# EAGLE design sel (EAGLE 9.6.2)

## Sheet 1 of 2
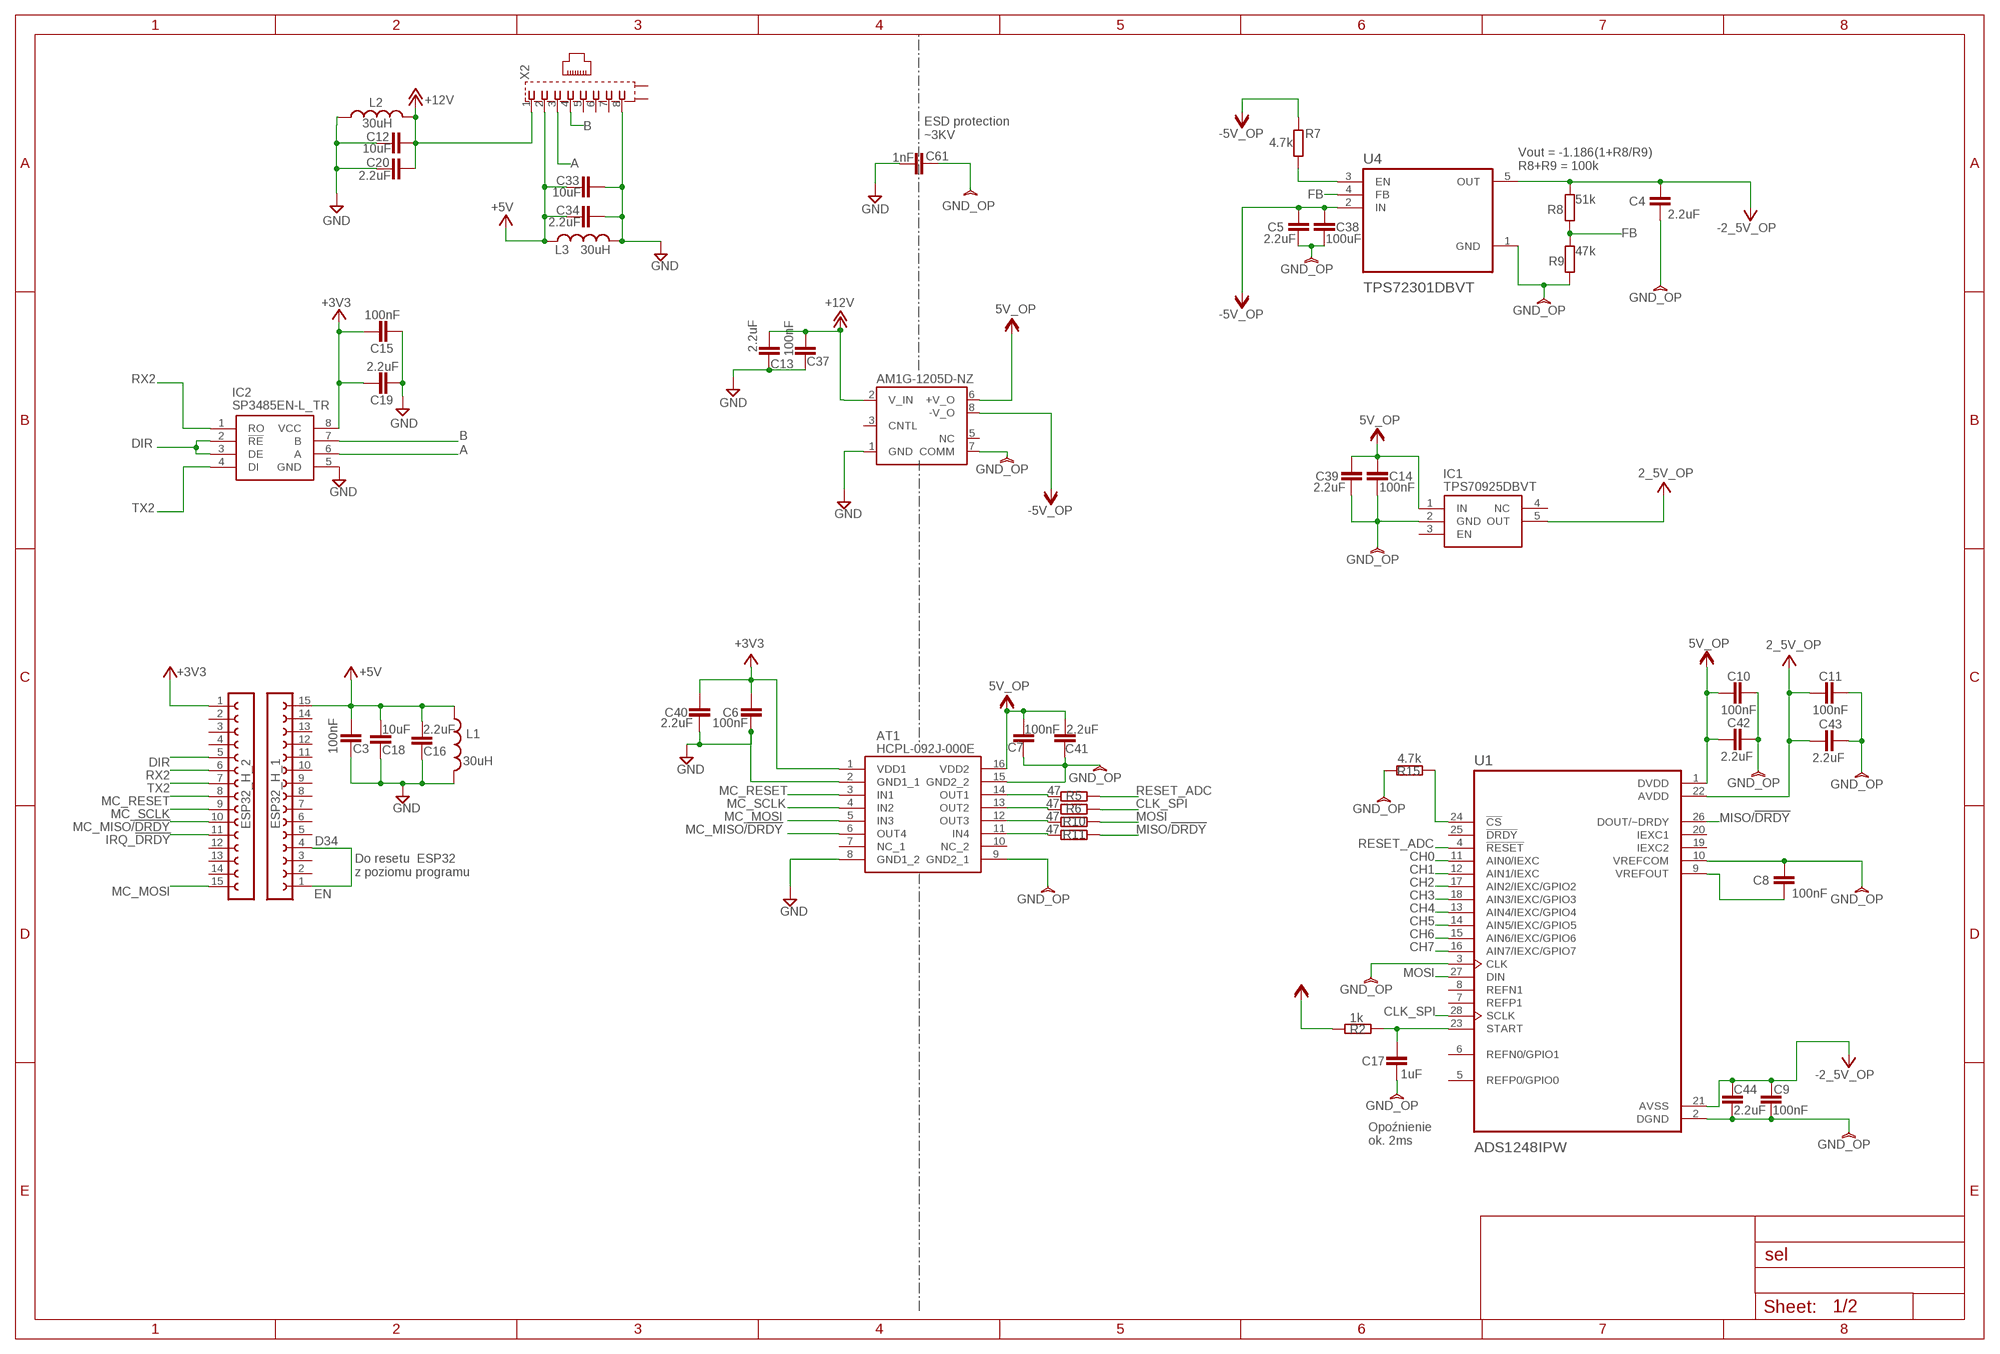
[diagram p0: schematic, sheet 1]

### Parts
AM1G-1205D-NZ  AM1G-1205D-NZ  [AM1G-1205D-NZ]
AT1  HCPL-092J-000E  [SOIC127P600X188-16N]
C3  100nF  C-EUC1206  [C1206]
C4  2.2uF  C-EUC1206  [C1206]
C5  2.2uF  C-EUC1206  [C1206]
C6  100nF  C-EUC1206  [C1206]
C7  100nF  C-EUC1206  [C1206]
C8  100nF  C-EUC1206  [C1206]
C9  100nF  C-EUC1206  [C1206]
C10  100nF  C-EUC1206  [C1206]
C11  100nF  C-EUC1206  [C1206]
C12  10uF  C-EUC1206  [C1206]
C13  2.2uF  C-EUC1206  [C1206]
C14  100nF  C-EUC1206  [C1206]
C15  100nF  C-EUC1206  [C1206]
C16  2.2uF  C-EUC1206  [C1206]
C17  1uF  C-EUC1206  [C1206]
C18  10uF  C-EUC1206  [C1206]
C19  2.2uF  C-EUC1206  [C1206]
C20  2.2uF  C-EUC1206  [C1206]
C33  10uF  C-EUC1206  [C1206]
C34  2.2uF  C-EUC1206  [C1206]
C37  100nF  C-EUC1206  [C1206]
C38  100uF  C-EUC1206  [C1206]
C39  2.2uF  C-EUC1206  [C1206]
C40  2.2uF  C-EUC1206  [C1206]
C41  2.2uF  C-EUC1206  [C1206]
C42  2.2uF  C-EUC1206  [C1206]
C43  2.2uF  C-EUC1206  [C1206]
C44  2.2uF  C-EUC1206  [C1206]
C61  1nF  C-EUC1206  [C1206]
ESP32_H_1  FE15-1  [FE15]
ESP32_H_2  FE15-1  [FE15]
IC1  TPS70925DBVT  [SOT95P280X145-5N]
IC2  SP3485EN-L_TR  [SOIC127P600X175-8N]
L1  30uH  L-US0204/7  [0204/7]
L2  30uH  L-US0204/7  [0204/7]
L3  30uH  L-US0204/7  [0204/7]
R2  1k  R-EU_R1206  [R1206]
R5  47  R-EU_R1206  [R1206]
R6  47  R-EU_R1206  [R1206]
R7  4.7k  R-EU_R1206  [R1206]
R8  51k  R-EU_R1206  [R1206]
R9  47k  R-EU_R1206  [R1206]
R10  47  R-EU_R1206  [R1206]
R11  47  R-EU_R1206  [R1206]
R15  4.7k  R-EU_R1206  [R1206]
U1  ADS1248IPW  [SOP65P640X120-28N]
U4  TPS72301DBVT  [SOT95P280X145-5N]
X2  0446200002  [0446200002]

### Nets
2_5V_OP: C11.2 C43.2 IC1.5(OUT) U1.22(AVDD)
5V_OP: AM1G-1205D-NZ.6(+V_O) AT1.16(VDD2) C7.1 C10.2 C14.1 C39.1 C41.1 C42.2 IC1.1(IN) R2.2 U1.1(DVDD) ; also sheet 2
+3V3: AT1.1(VDD1) C6.2 C15.2 C19.2 C40.2 ESP32_H_2.1 IC2.8(VCC)
+5V: C3.1 C16.1 C18.1 C33.2 C34.2 ESP32_H_1.15 L1.1 L3.1 X2.2
+12V: AM1G-1205D-NZ.2(V_IN) C12.1 C13.2 C20.1 C37.2 L2.2 X2.1
-2_5V_OP: C4.1 C9.1 C44.1 R8.2 U1.21(AVSS) U4.5(OUT)
-5V_OP: AM1G-1205D-NZ.8(-V_O) C5.1 C38.1 R7.1 U4.2(IN) ; also sheet 2
A: IC2.6(A) X2.3
B: IC2.7(B) X2.4
CH0: U1.11(AIN0/IEXC) ; also sheet 2
CH1: U1.12(AIN1/IEXC) ; also sheet 2
CH2: U1.17(AIN2/IEXC/GPIO2) ; also sheet 2
CH3: U1.18(AIN3/IEXC/GPIO3) ; also sheet 2
CH4: U1.13(AIN4/IEXC/GPIO4) ; also sheet 2
CH5: U1.14(AIN5/IEXC/GPIO5) ; also sheet 2
CH6: U1.15(AIN6/IEXC/GPIO6)
CH7: U1.16(AIN7/IEXC/GPIO7)
CLK_SPI: AT1.13(OUT2) R6.2 U1.28(SCLK)
DIR: ESP32_H_2.5 IC2.2(!RE) IC2.3(DE)
EN: ESP32_H_1.1 ESP32_H_1.4
FB: R8.1 R9.2 U4.4(FB)
GND: AM1G-1205D-NZ.1(GND) AT1.2(GND1_1) AT1.8(GND1_2) C3.2 C6.1 C12.2 C13.1 C15.1 C16.2 C18.2 C19.1 C20.2 C33.1 C34.1 C37.1 C40.1 C61.2 IC2.5(GND) L1.2 L2.1 L3.2 X2.8
GND_OP: AM1G-1205D-NZ.7(COMM) AT1.9(GND2_1) AT1.15(GND2_2) C4.2 C5.2 C7.2 C8.1 C9.2 C10.1 C11.1 C14.2 C17.2 C38.2 C39.2 C41.2 C42.1 C43.1 C44.2 C61.1 IC1.2(GND) R9.1 R15.2 U1.2(DGND) U1.3(CLK) U1.10(VREFCOM) U4.1(GND) ; also sheet 2
IRQ_!DRDY: ESP32_H_2.11
MC_MISO/!DRDY: AT1.6(OUT4) ESP32_H_2.10
MC_MOSI: AT1.5(IN3) ESP32_H_2.15
MC_RESET: AT1.3(IN1) ESP32_H_2.8
MC_SCLK: AT1.4(IN2) ESP32_H_2.9
MISO/!DRDY: AT1.11(IN4) R11.2 U1.26(DOUT/~DRDY)
MOSI: AT1.12(OUT3) R10.2 U1.27(DIN)
N$5: R5.1
N$6: R7.2 U4.3(EN)
N$7: R6.1
N$8: C8.2 U1.9(VREFOUT)
N$9: R10.1
N$10: R11.1
N$11: R15.1 U1.24(!CS)
RESET_ADC: AT1.14(OUT1) R5.2 U1.4(!RESET)
RX2: ESP32_H_2.6 IC2.1(RO)
START: C17.1 R2.1 U1.23(START)
TX2: ESP32_H_2.7 IC2.4(DI)
Unconnected: AM1G-1205D-NZ.3(CNTL) AM1G-1205D-NZ.5(NC) AT1.7(NC_1) AT1.10(NC_2) ESP32_H_1.2 ESP32_H_1.3 ESP32_H_1.5 ESP32_H_1.6 ESP32_H_1.7 ESP32_H_1.8 ESP32_H_1.9 ESP32_H_1.10 ESP32_H_1.11 ESP32_H_1.12 ESP32_H_1.13 ESP32_H_1.14 ESP32_H_2.2 ESP32_H_2.3 ESP32_H_2.4 ESP32_H_2.12 ESP32_H_2.13 ESP32_H_2.14 IC1.3(EN) IC1.4(NC) U1.5(REFP0/GPIO0) U1.6(REFN0/GPIO1) U1.7(REFP1) U1.8(REFN1) U1.19(IEXC2) U1.20(IEXC1) U1.25(!DRDY) X2.5 X2.6 X2.7 X2.S@1(S1) X2.S@2(S2)

### Notes on the sheet
- ESD protection
  ~3KV
- Vout = -1.186(1+R8/R9)
  R8+R9 = 100k
- D34
- Do resetu  ESP32
  z poziomu programu
- Opoźnienie 
  ok. 2ms

## Sheet 2 of 2
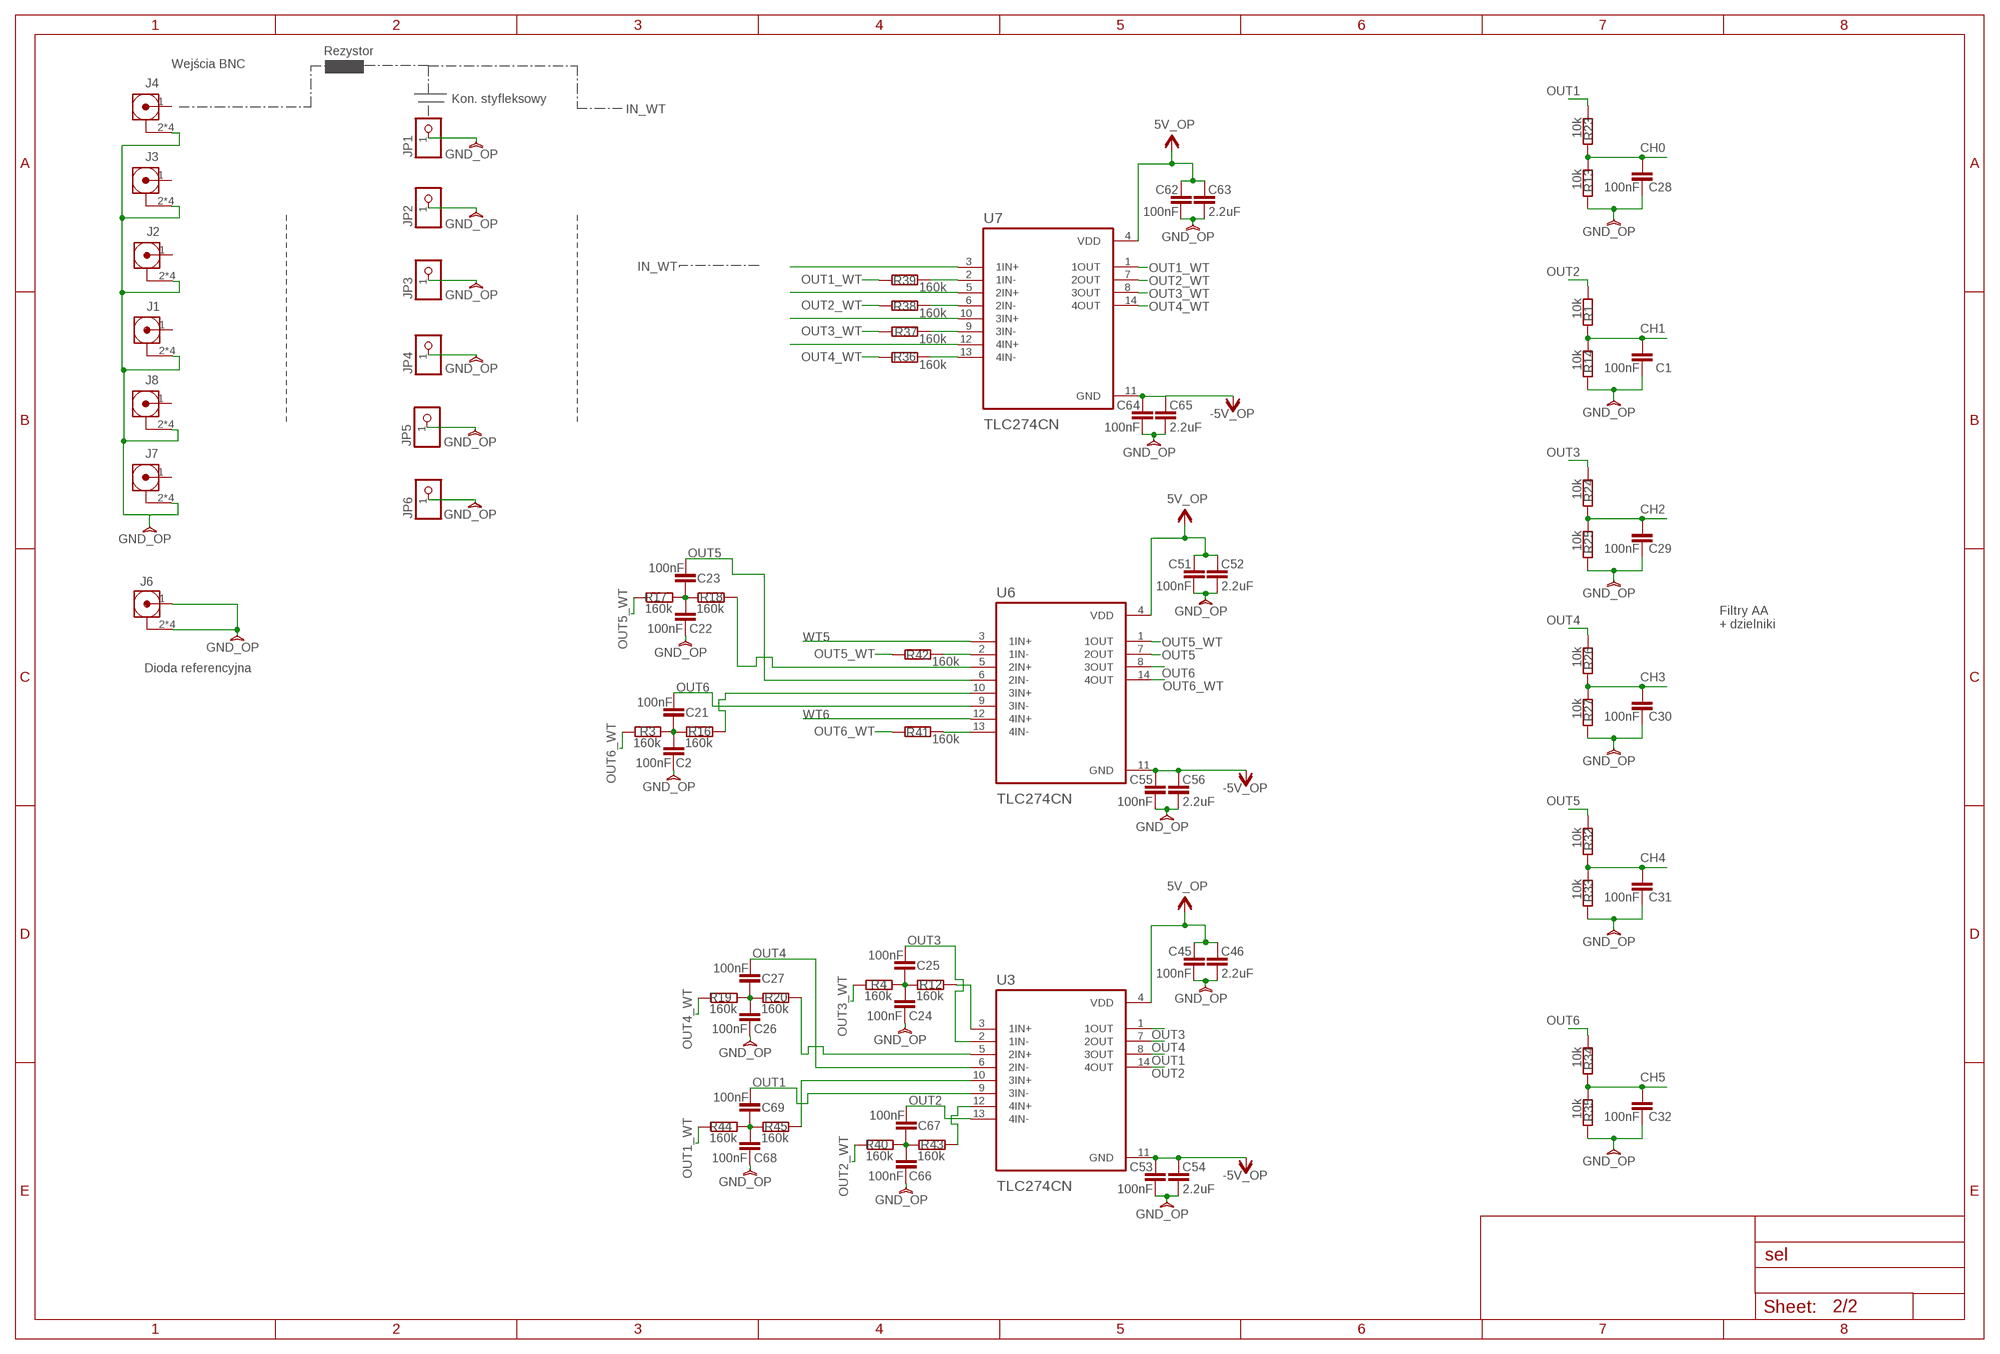
[diagram p1: schematic, sheet 2]

### Parts
C1  100nF  C-EUC1206  [C1206]
C2  100nF  C-EUC1206  [C1206]
C21  100nF  C-EUC1206  [C1206]
C22  100nF  C-EUC1206  [C1206]
C23  100nF  C-EUC1206  [C1206]
C24  100nF  C-EUC1206  [C1206]
C25  100nF  C-EUC1206  [C1206]
C26  100nF  C-EUC1206  [C1206]
C27  100nF  C-EUC1206  [C1206]
C28  100nF  C-EUC1206  [C1206]
C29  100nF  C-EUC1206  [C1206]
C30  100nF  C-EUC1206  [C1206]
C31  100nF  C-EUC1206  [C1206]
C32  100nF  C-EUC1206  [C1206]
C45  100nF  C-EUC1206  [C1206]
C46  2.2uF  C-EUC1206  [C1206]
C51  100nF  C-EUC1206  [C1206]
C52  2.2uF  C-EUC1206  [C1206]
C53  100nF  C-EUC1206  [C1206]
C54  2.2uF  C-EUC1206  [C1206]
C55  100nF  C-EUC1206  [C1206]
C56  2.2uF  C-EUC1206  [C1206]
C62  100nF  C-EUC1206  [C1206]
C63  2.2uF  C-EUC1206  [C1206]
C64  100nF  C-EUC1206  [C1206]
C65  2.2uF  C-EUC1206  [C1206]
C66  100nF  C-EUC1206  [C1206]
C67  100nF  C-EUC1206  [C1206]
C68  100nF  C-EUC1206  [C1206]
C69  100nF  C-EUC1206  [C1206]
J1  5-1634556-0  [TE_5-1634556-0]
J2  5-1634556-0  [TE_5-1634556-0]
J3  5-1634556-0  [TE_5-1634556-0]
J4  5-1634556-0  [TE_5-1634556-0]
J6  5-1634556-0  [TE_5-1634556-0]
J7  5-1634556-0  [TE_5-1634556-0]
J8  5-1634556-0  [TE_5-1634556-0]
JP1  PINHD-1X1  [1X01]
JP2  PINHD-1X1  [1X01]
JP3  PINHD-1X1  [1X01]
JP4  PINHD-1X1  [1X01]
JP5  PINHD-1X1  [1X01]
JP6  PINHD-1X1  [1X01]
R1  10k  R-EU_R1206  [R1206]
R3  160k  R-EU_R1206  [R1206]
R4  160k  R-EU_R1206  [R1206]
R12  160k  R-EU_R1206  [R1206]
R13  10k  R-EU_R1206  [R1206]
R14  10k  R-EU_R1206  [R1206]
R16  160k  R-EU_R1206  [R1206]
R17  160k  R-EU_R1206  [R1206]
R18  160k  R-EU_R1206  [R1206]
R19  160k  R-EU_R1206  [R1206]
R20  160k  R-EU_R1206  [R1206]
R23  10k  R-EU_R1206  [R1206]
R24  10k  R-EU_R1206  [R1206]
R25  10k  R-EU_R1206  [R1206]
R26  10k  R-EU_R1206  [R1206]
R27  10k  R-EU_R1206  [R1206]
R32  10k  R-EU_R1206  [R1206]
R33  10k  R-EU_R1206  [R1206]
R34  10k  R-EU_R1206  [R1206]
R35  10k  R-EU_R1206  [R1206]
R36  160k  R-EU_R1206  [R1206]
R37  160k  R-EU_R1206  [R1206]
R38  160k  R-EU_R1206  [R1206]
R39  160k  R-EU_R1206  [R1206]
R40  160k  R-EU_R1206  [R1206]
R41  160k  R-EU_R1206  [R1206]
R42  160k  R-EU_R1206  [R1206]
R43  160k  R-EU_R1206  [R1206]
R44  160k  R-EU_R1206  [R1206]
R45  160k  R-EU_R1206  [R1206]
U3  TLC274CN  [DIP794W45P254L1969H508Q14]
U6  TLC274CN  [DIP794W45P254L1969H508Q14]
U7  TLC274CN  [DIP794W45P254L1969H508Q14]

### Nets
1IN+: U7.3(1IN+)
2IN+: U7.5(2IN+)
3IN+: U7.10(3IN+)
3IN+_2: R16.1 U6.10(3IN+)
4IN+: U7.12(4IN+)
5V_OP: C45.2 C46.2 C51.2 C52.2 C62.2 C63.2 U3.4(VDD) U6.4(VDD) U7.4(VDD) ; also sheet 1
-5V_OP: C53.2 C54.2 C55.2 C56.2 C64.2 C65.2 U3.11(GND) U6.11(GND) U7.11(GND) ; also sheet 1
CH0: C28.1 R13.2 R23.1 ; also sheet 1
CH1: C1.1 R1.1 R14.2 ; also sheet 1
CH2: C29.1 R24.1 R25.2 ; also sheet 1
CH3: C30.1 R26.1 R27.2 ; also sheet 1
CH4: C31.1 R32.1 R33.2 ; also sheet 1
CH5: C32.1 R34.1 R35.2 ; also sheet 1
GND_OP: C1.2 C2.2 C22.2 C24.2 C26.2 C28.2 C29.2 C30.2 C31.2 C32.2 C45.1 C46.1 C51.1 C52.1 C53.1 C54.1 C55.1 C56.1 C62.1 C63.1 C64.1 C65.1 C66.2 C68.2 J1.2 J1.3 J1.4 J1.5 J2.2 J2.3 J2.4 J2.5 J3.2 J3.3 J3.4 J3.5 J4.2 J4.3 J4.4 J4.5 J6.1 J6.2 J6.3 J6.4 J6.5 J7.2 J7.3 J7.4 J7.5 J8.2 J8.3 J8.4 J8.5 JP1.1 JP2.1 JP3.1 JP4.1 JP5.1 JP6.1 R13.1 R14.1 R25.1 R27.1 R33.1 R35.1 ; also sheet 1
N$1: R41.1 U6.13(4IN-)
N$2: R42.1 U6.2(1IN-)
N$3: R18.1 U6.5(2IN+)
N$12: C24.1 C25.1 R4.1 R12.2
N$15: R12.1 U3.3(1IN+)
N$16: C26.1 C27.1 R19.1 R20.2
N$18: R20.1 U3.5(2IN+)
N$19: C2.1 C21.1 R3.1 R16.2
N$20: C66.1 C67.1 R40.1 R43.2
N$21: C22.1 C23.1 R17.1 R18.2
N$30: C68.1 C69.1 R44.1 R45.2
N$37: R43.1 U3.12(4IN+)
N$38: R45.1 U3.10(3IN+)
N$44: R36.1 U7.13(4IN-)
N$45: R37.1 U7.9(3IN-)
N$46: R38.1 U7.6(2IN-)
N$47: R39.1 U7.2(1IN-)
OUT1: C69.2 R23.2 U3.8(3OUT) U3.9(3IN-)
OUT1_WT: R39.2 R44.2 U7.1(1OUT)
OUT2: C67.2 R1.2 U3.13(4IN-) U3.14(4OUT)
OUT2_WT: R38.2 R40.2 U7.7(2OUT)
OUT3: C25.2 R24.2 U3.1(1OUT) U3.2(1IN-)
OUT3_WT: R4.2 R37.2 U7.8(3OUT)
OUT4: C27.2 R26.2 U3.6(2IN-) U3.7(2OUT)
OUT4_WT: R19.2 R36.2 U7.14(4OUT)
OUT5: C23.2 R32.2 U6.6(2IN-) U6.7(2OUT)
OUT5_WT: R17.2 R42.2 U6.1(1OUT)
OUT6: C21.2 R34.2 U6.8(3OUT) U6.9(3IN-)
OUT6_WT: R3.2 R41.2 U6.14(4OUT)
WT5: U6.3(1IN+)
WT6: U6.12(4IN+)
Unconnected: J1.1 J2.1 J3.1 J4.1 J7.1 J8.1

### Notes on the sheet
- Rezystor
- Wejścia BNC
- Kon. styfleksowy
- IN_WT
- IN_WT
- Filtry AA
  + dzielniki
- Dioda referencyjna

## Library data of the parts
AM1G-1205D-NZ = AM!G-NZ:AM1G-1205D-NZ
AT1 = SamacSys_Parts:HCPL-092J-000E: Broadcom HCPL-092J-000E PCB SMT 3-channel Digital Isolator, 2500 Vrms, 16-Pin SO Source: Datasheet <https://docs.broadcom.com/docs/AV02-0137EN>; DESCRIPTION: Broadcom HCPL-092J-000E PCB SMT 3-channel Digital Isolator, 2500 Vrms, 16-Pin SO; HEIGHT: 1.88mm; MANUFACTURER_NAME: Avago Technologies; MANUFACTURER_PART_NUMBER: HCPL-092J-000E; MOUSER_PART_NUMBER: 630-HCPL-092J-000E; MOUSER_PRICE-STOCK: https://www.mouser.co.uk/ProductDetail/Broadcom-Avago/HCPL-092J-000E?qs=xnajaXqBF9%2FaS9uGq9p%252BqQ%3D%3D
C1-C34 C37-C46 C51-C56 C61-C69 = rcl:C-EU: CAPACITOR, European symbol; SPICEPREFIX: C
ESP32_H_1 ESP32_H_2 = con-lsta:FE15-1: FEMALE HEADER; OC_FARNELL: unknown; OC_NEWARK: unknown
IC1 = SamacSys_Parts:TPS70925DBVT: Texas Instruments TPS70925DBVT, LDO Voltage Regulator, 500mA, 2.5 V 1%, 2.7 30 Vin, 5-Pin SOT-23 Source: Datasheet <http://www.ti.com/lit/gpn/TPS709>; DESCRIPTION: Texas Instruments TPS70925DBVT, LDO Voltage Regulator, 500mA, 2.5 V 1%, 2.7 30 Vin, 5-Pin SOT-23; HEIGHT: 1.45mm; MANUFACTURER_NAME: Texas Instruments; MANUFACTURER_PART_NUMBER: TPS70925DBVT; MOUSER_PART_NUMBER: 595-TPS70925DBVT; MOUSER_PRICE-STOCK: https://www.mouser.co.uk/ProductDetail/Texas-Instruments/TPS70925DBVT?qs=Z9twEOuL%252B%2FLwfjdk3C644Q%3D%3D
IC2 = SamacSys_Parts:SP3485EN-L_TR: RS-485 Interface IC 3.3V LoPwr Half-Dup RS485w/10Mbps Data Source: Datasheet <https://www.maxlinear.com/ds/sp3485.pdf>; DESCRIPTION: RS-485 Interface IC 3.3V LoPwr Half-Dup RS485w/10Mbps Data; HEIGHT: 1.75mm; MANUFACTURER_NAME: MaxLinear, Inc.; MANUFACTURER_PART_NUMBER: SP3485EN-L/TR; MOUSER_PART_NUMBER: 701-SP3485EN-L/TR; MOUSER_PRICE-STOCK: https://www.mouser.co.uk/ProductDetail/MaxLinear/SP3485EN-L-TR?qs=3EMgrMjM0fbQ17liGrle%2Fg%3D%3D
J1-J4 J6-J8 = 5-1634556-0:5-1634556-0: CONN BNC JACK R/A 50 OHM PCB Check prices <https://pricing.snapeda.com/parts/5-1634556-0/TE%20Connectivity/view-part?ref=eda>; AVAILABILITY: Good; COMMENT: 5-1634556-0; DESCRIPTION: Right Angle 50Ohm Thru Hole Bulkhead Fitting BNC Conn; jack; Solder Term Nickel; EU_ROHS_COMPLIANCE: Compliant; MF: TE Connectivity; MP: 5-1634556-0; NUMBER_OF_POSITIONS: 1; PACKAGE: None; PRICE: None; PURCHASE-URL: https://pricing.snapeda.com/search/part/5-1634556-0/?ref=eda
JP1-JP6 = pinhead:PINHD-1X1: PIN HEADER
L1-L3 = rcl:L-US: INDUCTOR, American symbol; SPICEPREFIX: L
R1-R20 R23-R27 R32-R45 = rcl:R-EU_: RESISTOR, European symbol; SPICEPREFIX: R
U1 = ADS1248IPW:ADS1248IPW: Check prices <https://pricing.snapeda.com/parts/ADS1248IPW/Texas%20Instruments/view-part?ref=eda>; AVAILABILITY: Warning; DESCRIPTION: 24-Bit, 2kSPS, 8-Ch Delta-Sigma ADC for Precision Sensor Measurement 28-TSSOP -40 to 125; MF: Texas Instruments; MP: ADS1248IPW; PACKAGE: TSSOP-28 Texas Instruments; PRICE: None; PURCHASE-URL: https://pricing.snapeda.com/search/part/ADS1248IPW/?ref=eda
U3 U6 U7 = TLC274CN:TLC274CN: Check prices <https://pricing.snapeda.com/parts/TLC274CN/Texas%20Instruments/view-part?ref=eda>; AVAILABILITY: Good; DESCRIPTION: Quad Single Supply Operational Amplifier 14-PDIP 0 to 70; MF: Texas Instruments; MP: TLC274CN; PACKAGE: PDIP-14 Texas Instruments; PRICE: None; PURCHASE-URL: https://pricing.snapeda.com/search/part/TLC274CN/?ref=eda
U4 = TPS72301DBVT:TPS72301DBVT: Check prices <https://pricing.snapeda.com/parts/TPS72301DBVT/Texas%20Instruments/view-part?ref=eda>; AVAILABILITY: Good; DESCRIPTION: 200-mA, negative, adjustable low-dropout voltage regulator with enable 5-SOT-23 -40 to 125; MF: Texas Instruments; MP: TPS72301DBVT; PACKAGE: SOT-23-5 Texas Instruments; PRICE: None; PURCHASE-URL: https://pricing.snapeda.com/search/part/TPS72301DBVT/?ref=eda
X2 = con-molex:0446200002: RJ-45 INVERTED MODULAR JACK ASSEMBLY WITH RJ-11 KEEPOUT FEATURE Source: Data sheet <http://www.farnell.com/datasheets/73207.pdf> MOLEX 0446200002 BUCHSE, RJ45, GESCHIRMT Source: Farnell <http://de.farnell.com/molex/0446200002/buchse-rj45-geschirmt/dp/9251910?ost=9251910>; MF: MOLEX; MPN: 0446200002; OC_FARNELL: 9251910

## Board
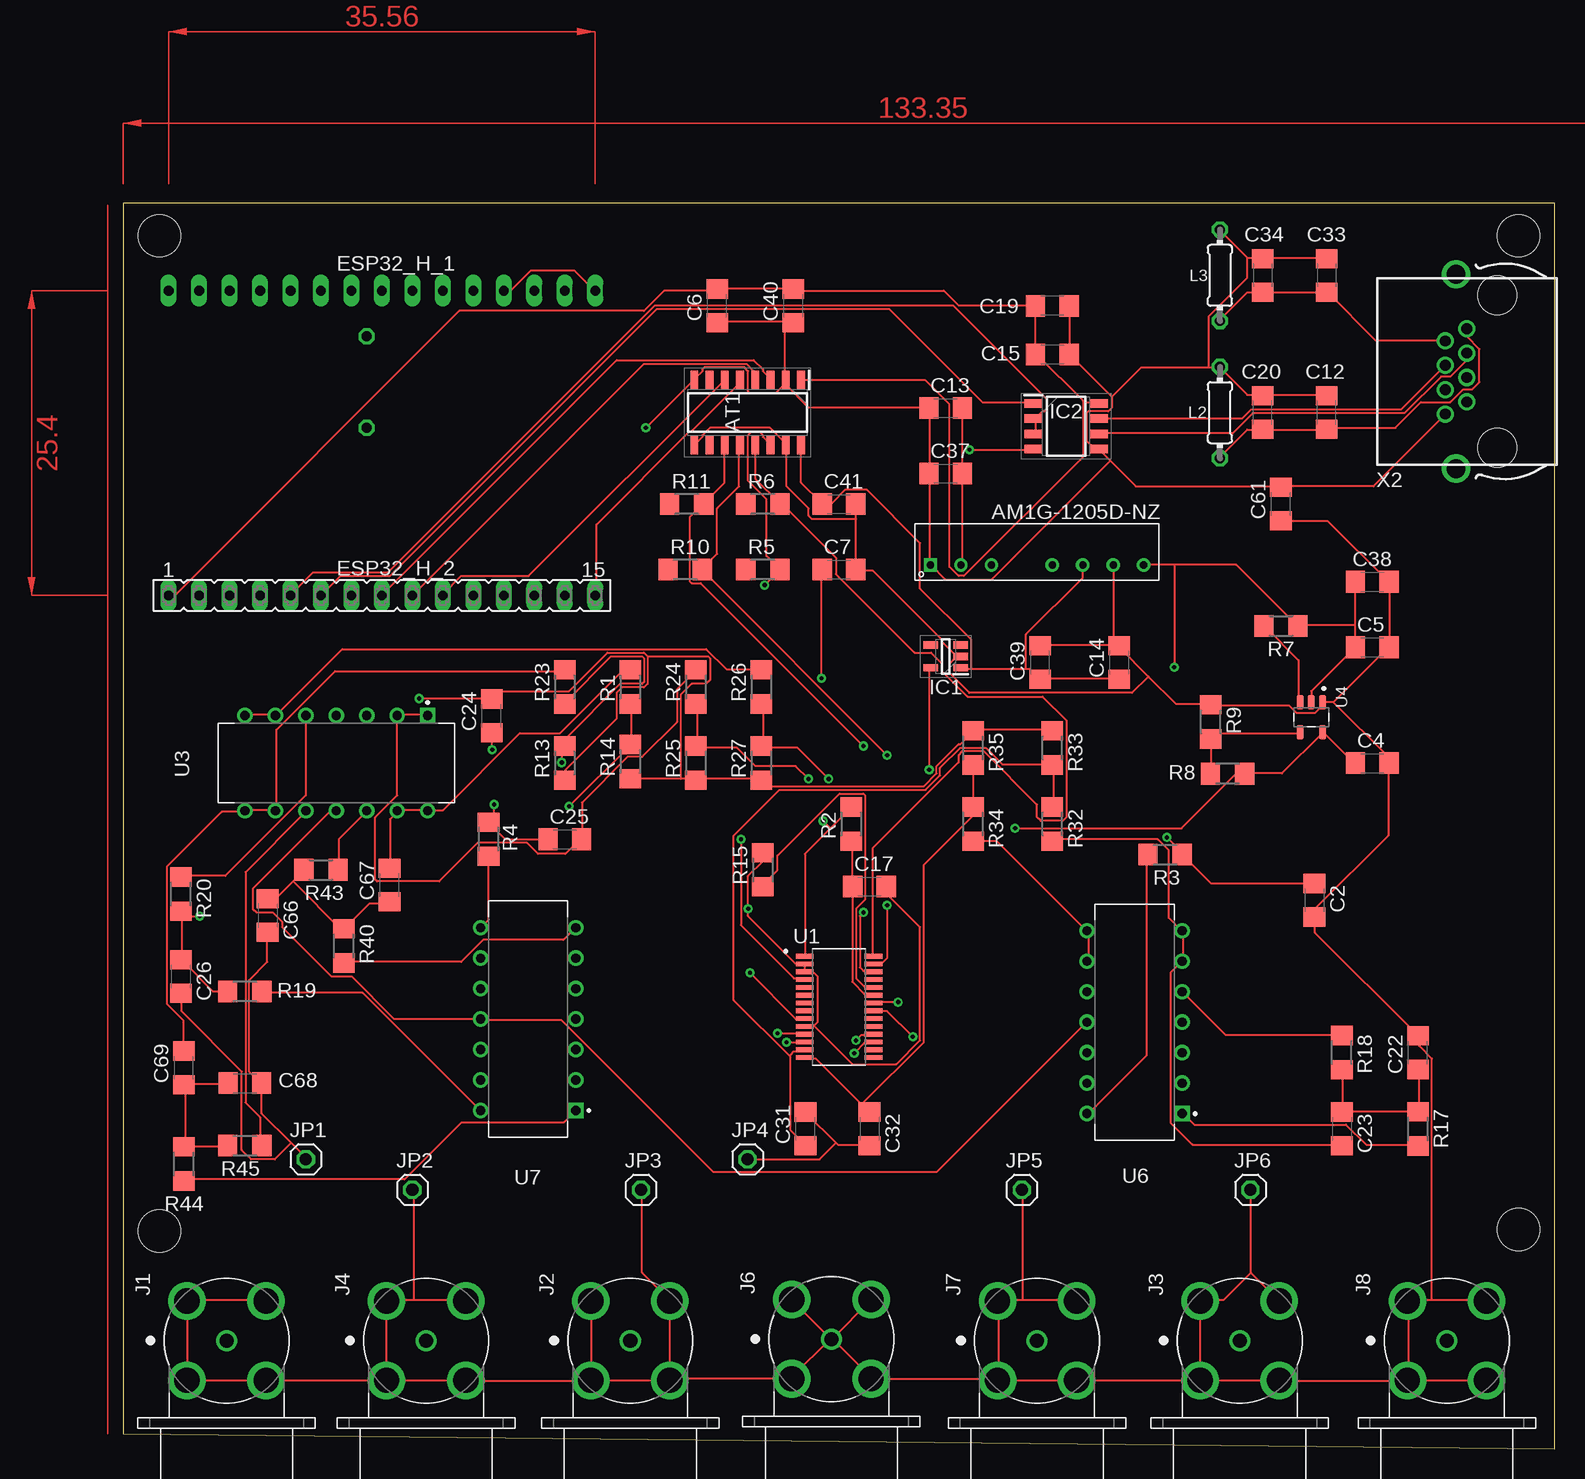
[diagram p2: board, top side]
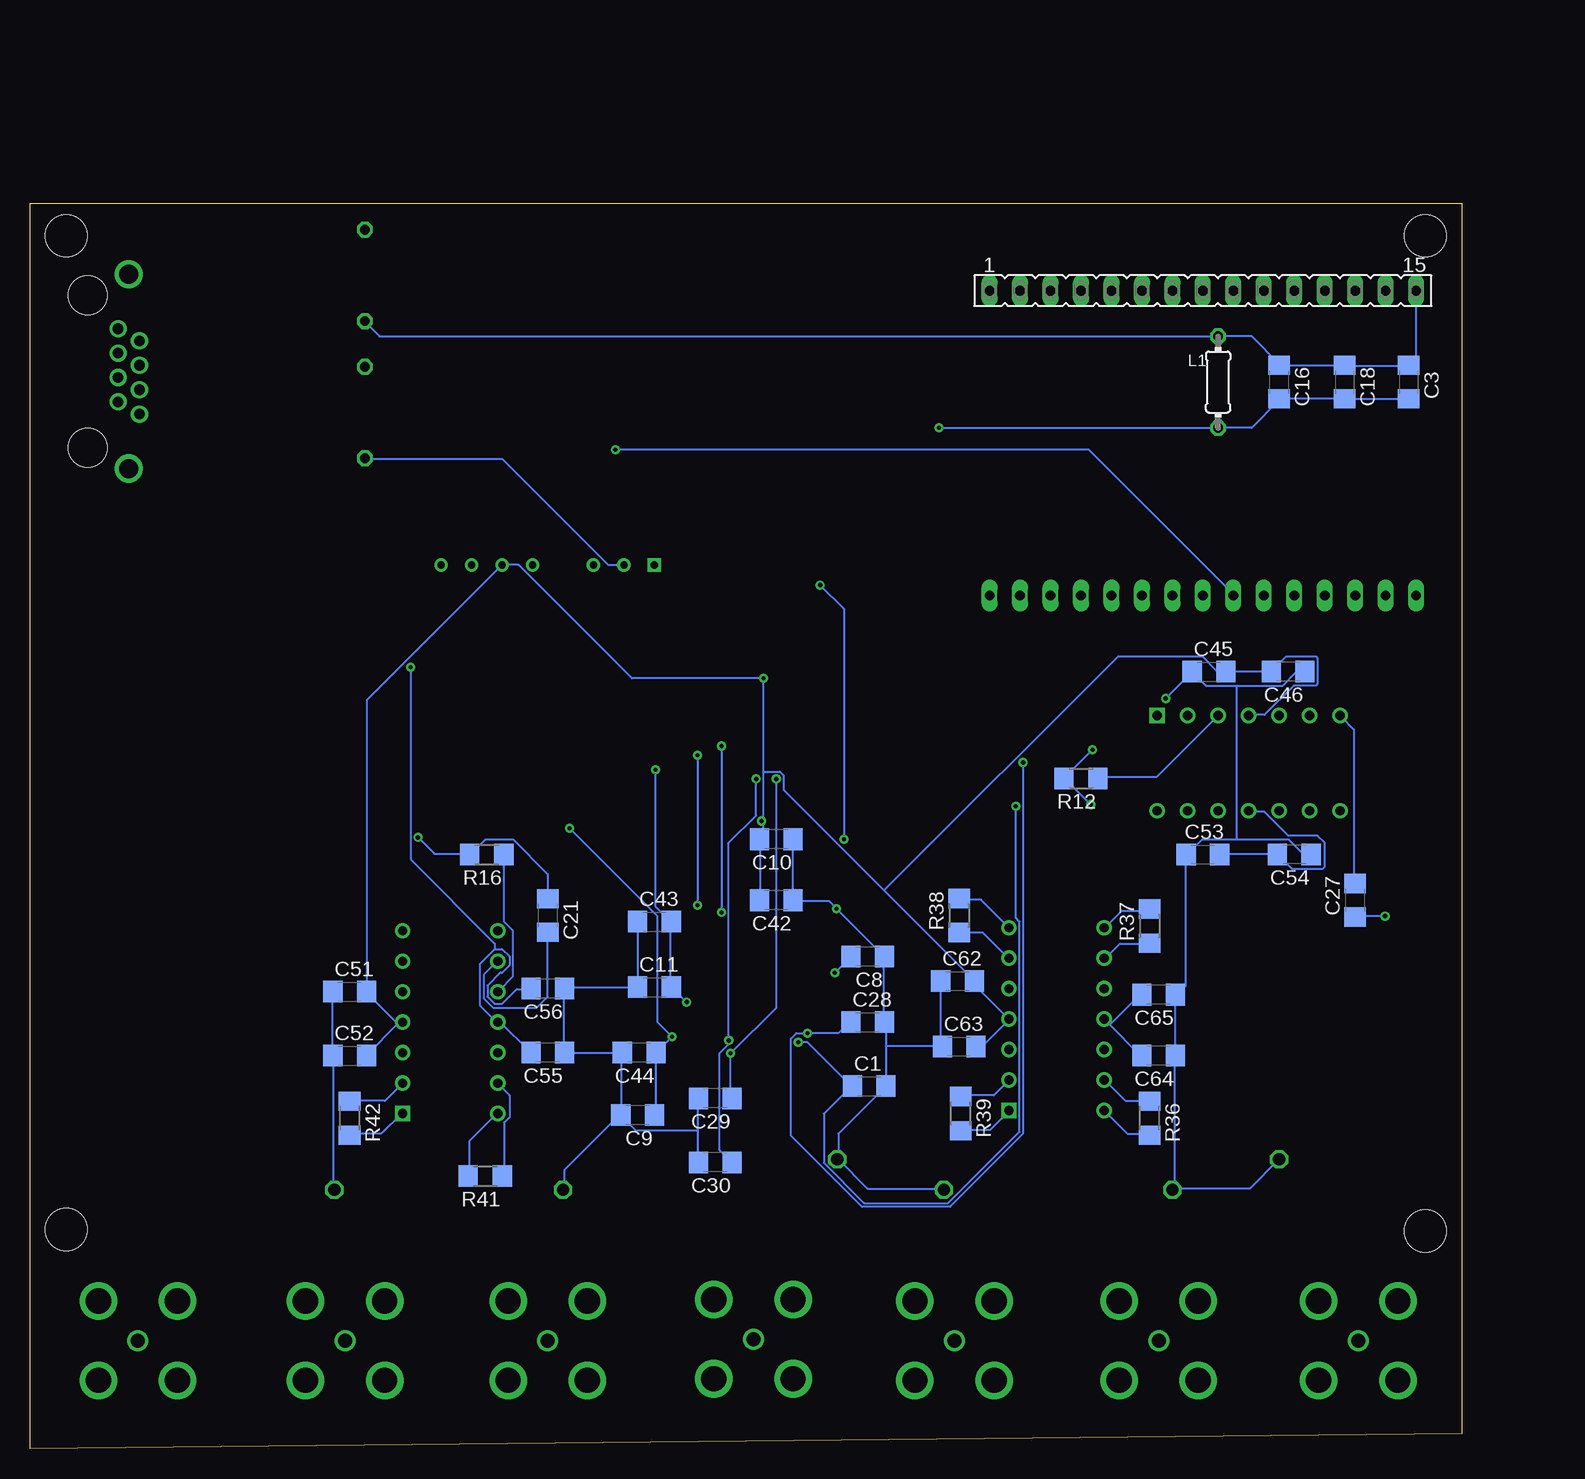
[diagram p3: board, bottom side, seen from below]

Size 119.36 x 103.81 mm. Coordinates in mm from the lower left corner, seen from the top.
Outline: 0,1.27 119.36,0 119.36,103.81 0,103.81 0,1.27
Copper layers (1*16): Top 0.035mm / dielectric 1.5mm / Bottom 0.035mm
Design rules "default": minimum track width 6mil, minimum drill 0.35mm, track to track 6mil, track to pad 6mil, pad to pad 6mil, via to via 6mil, smd to smd 6mil, copper to edge 40mil, drill to drill 6mil, minimum pad ring 10mil, minimum via ring 8mil, stop-mask expansion 4mil, vias tented up to drill 0mil, thermal gap 10mil
Holes 3.5 mm at 116.33,101.09 3.05,101.09 3.05,18.16 116.33,18.29

### Footprints (pad centres in the part's own frame; a part is rotated, then mirrored left to right if it is on the bottom)
AM1G-1205D-NZ = drill 0.6 square: 1 -20.32,0 | drill 0.6: 2 -17.78,0; 3 -15.24,0; 5 -10.16,0; 6 -7.62,0; 7 -5.08,0; 8 -2.54,0
SOIC127P600X188-16N = smd 1.525 x 0.65: 1 -2.712,4.445; 2 -2.712,3.175; 3 -2.712,1.905; 4 -2.712,0.635; 5 -2.712,-0.635; 6 -2.712,-1.905; 7 -2.712,-3.175; 8 -2.712,-4.445; 9 2.712,-4.445; 10 2.712,-3.175; 11 2.712,-1.905; 12 2.712,-0.635; 13 2.712,0.635; 14 2.712,1.905; 15 2.712,3.175; 16 2.712,4.445
C1206 = smd 1.6 x 1.8: 1 -1.4,0; 2 1.4,0
FE15 = drill 0.813 long: 1 -17.78,0; 2 -15.24,0; 3 -12.7,0; 4 -10.16,0; 5 -7.62,0; 6 -5.08,0; 7 -2.54,0; 8 0,0; 9 2.54,0; 10 5.08,0; 11 7.62,0; 12 10.16,0; 13 12.7,0; 14 15.24,0; 15 17.78,0
SOT95P280X145-5N = smd 1.2 x 0.6: 1 -1.25,0.95; 2 -1.25,0; 3 -1.25,-0.95; 4 1.25,-0.95; 5 1.25,0.95
SOIC127P600X175-8N = smd 1.525 x 0.7: 1 -2.712,1.905; 2 -2.712,0.635; 3 -2.712,-0.635; 4 -2.712,-1.905; 5 2.712,-1.905; 6 2.712,-0.635; 7 2.712,0.635; 8 2.712,1.905
TE_5-1634556-0 = drill 1.17: 1 0,0 | drill 2.11: 2 3.3,3.3; 3 -3.3,3.3; 4 -3.3,-3.3; 5 3.3,-3.3
1X01 = drill 1.016 octagon: 1 0,0
0204/7 = drill 0.813 octagon: 1 -3.81,0; 2 3.81,0
R1206 = smd 1.6 x 1.803: 1 -1.422,0; 2 1.422,0
SOP65P640X120-28N = smd 1.57 x 0.41: 1 -2.87,4.225; 2 -2.87,3.575; 3 -2.87,2.925; 4 -2.87,2.275; 5 -2.87,1.625; 6 -2.87,0.975; 7 -2.87,0.325; 8 -2.87,-0.325; 9 -2.87,-0.975; 10 -2.87,-1.625; 11 -2.87,-2.275; 12 -2.87,-2.925; 13 -2.87,-3.575; 14 -2.87,-4.225; 15 2.87,-4.225; 16 2.87,-3.575; 17 2.87,-2.925; 18 2.87,-2.275; 19 2.87,-1.625; 20 2.87,-0.975; 21 2.87,-0.325; 22 2.87,0.325; 23 2.87,0.975; 24 2.87,1.625; 25 2.87,2.275; 26 2.87,2.925; 27 2.87,3.575; 28 2.87,4.225
DIP794W45P254L1969H508Q14 = drill 0.77 pad 1.17 square: 1 -3.97,7.62 | drill 0.77 pad 1.17: 2 -3.97,5.08; 3 -3.97,2.54; 4 -3.97,0; 5 -3.97,-2.54; 6 -3.97,-5.08; 7 -3.97,-7.62; 8 3.97,-7.62; 9 3.97,-5.08; 10 3.97,-2.54; 11 3.97,0; 12 3.97,2.54; 13 3.97,5.08; 14 3.97,7.62
SOT95P280X145-5N' = smd 1.21 x 0.59: 1 -1.255,0.95; 2 -1.255,0; 3 -1.255,-0.95; 4 1.255,-0.95; 5 1.255,0.95
0446200002 = drill 0.889 pad 1.422: 1 3.556,2.54; 2 2.54,4.318; 3 1.524,2.54; 4 0.508,4.318; 5 -0.508,2.54; 6 -1.524,4.318; 7 -2.54,2.54; 8 -3.556,4.318 | drill 1.575 pad 2.286: S@1 -8.103,3.429; S@2 8.103,3.429 | hole 3.251: 6.35,0; -6.35,0

### Placement (x,y rotation side)
AM1G-1205D-NZ  87.63,73.66 0 top
AT1  52.07,86.36 270 top
C1  49.4,30.23 0 bottom
C2  99.31,45.72 270 top
C3  4.45,88.9 270 bottom
C4  104.14,57.15 0 top
C5  104.14,66.8 0 top
C6  49.53,95.25 90 top
C7  59.69,73.28 0 top
C8  49.53,41.02 180 bottom
C9  68.71,27.81 180 bottom
C10  57.15,50.8 180 bottom
C11  67.31,38.48 0 bottom
C12  100.33,86.36 90 top
C13  68.58,86.74 0 top
C14  83.06,65.53 90 top
C15  77.47,91.19 180 top
C16  15.24,88.9 270 bottom
C17  62.23,46.86 0 top
C18  9.78,88.9 270 bottom
C19  77.47,95.25 180 top
C20  95,86.36 90 top
C21  76.2,44.45 270 bottom
C22  107.95,33.02 90 top
C23  101.6,26.67 270 top
C24  30.73,61.09 90 top
C25  36.83,50.8 0 top
C26  4.83,39.37 270 top
C27  8.89,45.72 90 bottom
C28  49.53,35.56 0 bottom
C29  62.23,29.21 180 bottom
C30  62.23,23.88 180 bottom
C31  56.9,26.67 90 top
C32  62.23,26.67 270 top
C33  100.33,97.79 270 top
C34  95,97.79 270 top
C37  68.58,81.28 0 top
C38  104.14,72.26 0 top
C39  76.45,65.53 90 top
C40  55.88,95.25 90 top
C41  59.69,78.74 0 top
C42  57.15,45.72 180 bottom
C43  67.31,43.94 0 bottom
C44  68.58,33.02 180 bottom
C45  21.08,64.77 0 bottom
C46  14.48,64.77 180 bottom
C51  92.71,38.1 0 bottom
C52  92.71,32.77 0 bottom
C53  21.59,49.53 0 bottom
C54  13.97,49.53 180 bottom
C55  76.2,33.02 180 bottom
C56  76.2,38.35 180 bottom
C61  96.52,78.74 90 top
C62  42.04,38.99 0 bottom
C63  41.91,33.53 0 bottom
C64  25.27,32.77 180 bottom
C65  25.27,37.85 180 bottom
C66  12.06,44.45 270 top
C67  22.23,46.99 90 top
C68  10.16,30.48 0 top
C69  5.08,31.75 90 top
ESP32_H_1  21.59,96.52 0 bottom
ESP32_H_2  21.59,71.12 0 top
IC1  68.58,66.04 180 top
IC2  78.61,85.22 0 top
J1  8.64,9.02 90 top
J2  42.29,9.02 90 top
J3  93.09,9.02 90 top
J4  25.27,9.02 90 top
J6  59.05,9.14 90 top
J7  76.2,9.02 90 top
J8  110.36,9.02 90 top
JP1  15.24,24.13 0 top
JP2  24.13,21.59 0 top
JP3  43.18,21.59 0 top
JP4  52.07,24.13 0 top
JP5  74.93,21.59 0 top
JP6  93.98,21.59 0 top
L1  20.32,88.9 270 bottom
L2  91.44,86.36 270 top
L3  91.44,97.79 90 top
R1  42.29,63.5 90 top
R2  60.71,52.07 90 top
R3  86.87,49.53 180 top
R4  30.48,50.8 270 top
R5  53.34,73.28 0 top
R6  53.34,78.74 0 top
R7  96.52,68.58 180 top
R8  92.08,56.26 0 top
R9  90.68,60.58 270 top
R10  46.86,73.28 0 top
R11  46.99,78.74 0 top
R12  31.75,55.88 180 bottom
R13  36.83,57.15 90 top
R14  42.29,57.28 90 top
R15  53.34,48.26 90 top
R16  81.28,49.53 180 bottom
R17  107.95,26.67 270 top
R18  101.6,33.02 270 top
R19  10.16,38.1 0 top
R20  4.83,46.23 270 top
R23  36.83,63.5 90 top
R24  47.75,63.5 90 top
R25  47.75,57.15 90 top
R26  53.21,63.5 90 top
R27  53.21,57.15 90 top
R32  77.47,52.07 270 top
R33  77.47,58.42 270 top
R34  70.87,52.07 270 top
R35  70.87,58.42 270 top
R36  26.04,27.56 270 bottom
R37  26.04,43.56 90 bottom
R38  41.91,44.45 90 bottom
R39  41.78,27.94 270 bottom
R40  18.41,41.91 270 top
R41  81.41,22.73 180 bottom
R42  92.71,27.56 270 bottom
R43  16.51,48.26 180 top
R44  5.08,23.75 270 top
R45  10.16,25.27 180 top
U1  59.69,36.83 0 top
U3  17.78,57.15 270 top
U4  TPS72301DBVT  [SOT95P280X145-5N']  99.06,60.96 270 top
U6  84.33,35.56 180 top
U7  33.78,35.81 180 top
X2  114.55,89.79 90 top

### Tracks (layer width: path | path; a pad name or v marks a point on that pad's centre or on a via)
2_5V_OP  (via drill 0.35)
  Top 0.152: v64.62,37.24 62.64,37.24 U1.22 | v67.21,56.59 67.21,64.97 IC1.5
  Bottom 0.152: v64.62,37.24 65.84,38.46 C11.2 65.99,38.61 65.99,43.94 | v67.21,56.59 67.21,45.16 65.99,43.94 | 65.99,43.94 C43.2
3IN+_2
  Bottom 0.152: R16.1 79.86,49.43 79.86,43.94 79.1,43.18 79.1,39.37 80.31,38.15 U6.10
5V_OP  (via drill 0.35)
  Top 0.152: AT1.16 56.54,83.57 56.54,80.52 58.22,78.84 C41.1 58.37,78.84 59.13,78.84 60.2,79.91 62.03,79.91 66.45,75.49 66.45,71.68 70.71,67.41 70.71,64.97 | 75.29,64.97 75.59,64.97 76.35,64.21 C39.1 76.5,64.21 83.06,64.21 C14.1 | 75.29,64.97 70.71,64.97 | 70.71,64.97 69.95,64.97 IC1.1 | AM1G-1205D-NZ.6 80.01,72.59 75.29,67.87 75.29,64.97 | 58.98,51.71 60.66,53.39 R2.2 | 58.98,51.71 56.84,49.58 56.84,41.2 U1.1 | v58.22,64.21 58.22,73.2 C7.1 | v58.37,52.32 58.98,51.71
  Bottom 0.152: 88.7,35.41 88.54,35.56 U6.4 88.7,35.41 | 88.7,35.41 91.29,32.82 C52.2 | 88.7,35.41 91.29,38 C51.2 91.29,38.15 91.29,62.38 AM1G-1205D-NZ.6 78.64,73.66 69.19,64.21 v58.22,64.21 58.22,56.44 | U3.4 17.68,61.16 16.46,61.16 14.02,63.6 12.19,63.6 12.04,63.75 12.04,65.89 12.19,66.04 14.63,66.04 15.85,64.82 C46.2 16,64.82 19.66,64.82 C45.2 19.81,64.82 20.42,64.82 21.64,66.04 28.65,66.04 48.16,46.53 | C63.2 40.39,33.58 39.93,33.58 37.8,35.71 U7.4 37.8,35.87 40.54,38.61 40.54,38.91 C62.2 40.69,39.07 48.16,46.53 | 58.52,50.8 58.52,45.77 C42.2 | 58.22,52.32 58.22,51.11 58.52,50.8 | 58.22,52.32 58.22,56.44 | 58.52,50.8 C10.2 | 48.16,46.53 56.54,54.92 56.54,56.13 56.84,56.44 58.22,56.44 | 58.22,52.32 v58.37,52.32
+3V3
  Top 0.152: 80.01,87.38 76.2,91.19 C15.2 76.05,91.19 76.05,95.15 C19.2 76.05,95.3 69.65,95.3 68.43,96.52 55.93,96.52 C40.2 55.78,96.67 49.53,96.67 C6.2 49.53,96.52 45.11,96.52 43.43,94.84 28.04,94.84 4.42,71.22 3.81,71.22 ESP32_H_2.1 | 80.01,87.38 80.16,87.22 81.23,87.22 IC2.8 | 80.01,87.38 80.01,82.65 70.1,72.75 69.65,72.75 68.89,73.51 68.89,87.07 66.9,89.05 56.54,89.05 AT1.1
+5V
  Top 0.152: L3.1 91.44,94.08 93.73,96.37 94.94,96.37 C34.2 95.1,96.37 100.28,96.37 C33.2 100.43,96.37 104.39,92.41 110.19,92.41 X2.2
  Bottom 0.152: ESP32_H_1.15 3.81,91.03 4.42,90.42 C3.1 4.57,90.27 9.75,90.27 C18.1 9.91,90.27 15.24,90.27 C16.1 15.24,90.42 17.53,92.71 L1.1 90.22,92.71 91.44,93.93 L3.1
+12V
  Top 0.152: 69.95,81.28 69.95,86.61 C13.2 | 69.95,81.28 69.95,73.66 AM1G-1205D-NZ.2 | 69.95,81.28 C37.2 | L2.2 91.44,82.65 93.73,84.94 94.94,84.94 C20.1 95.1,84.94 100.28,84.94 C12.1 100.43,85.09 106.07,85.09 108.2,87.22 110.64,87.22 111.71,88.29 112.47,88.29 113.08,88.9 113.08,91.64 112.01,92.71 X2.1
  Bottom 0.152: AM1G-1205D-NZ.2 71.17,73.66 80.01,82.5 91.44,82.5 L2.2
-2_5V_OP  (via drill 0.35)
  Top 0.152: C4.1 102.72,57.05 100.13,59.64 U4.5 99.97,59.64 96.62,56.29 93.57,56.29 R8.2 93.42,56.13 92.66,56.13 88.24,51.71 v74.37,51.71 | v65.84,34.34 63.7,36.47 62.64,36.47 U1.21
  Bottom 0.152: C9.1 67.21,27.94 67.21,32.97 C44.1 67.06,33.12 v65.84,34.34 67.06,35.56 67.06,44.4 v74.37,51.71
-5V_OP  (via drill 0.35)
  Top 0.152: U3.11 17.68,53.09 17.22,53.09 10.82,46.69 10.82,45.01 11.12,44.7 12.5,44.7 13.26,43.94 13.26,43.49 17.37,39.37 19.05,39.37 22.55,35.87 29.72,35.87 U7.11 29.87,35.71 36.58,35.71 49.23,23.06 67.82,23.06 80.31,35.56 U6.11 | U4.2 99.06,63.14 102.72,66.8 | 102.72,66.8 102.72,68.63 | 102.72,68.63 102.72,72.14 C38.1 | 102.72,66.8 C5.1 | 102.72,68.63 97.99,68.63 R7.1 97.84,68.63 92.81,73.66 87.63,73.66 | 87.63,73.66 AM1G-1205D-NZ.8 | 87.63,73.66 v87.63,65.13
  Bottom 0.152: 29.41,35.41 29.72,35.71 U7.11 29.41,35.41 | 29.41,35.41 26.82,32.82 C64.2 | 29.41,35.41 29.26,35.41 26.82,37.85 C65.2 | C53.2 20.12,49.58 15.39,49.58 C54.2 15.24,49.43 14.17,48.36 11.58,48.36 11.43,48.51 11.43,50.5 12.04,51.11 14.48,51.11 16.46,53.09 17.68,53.09 U3.11 | C55.2 77.72,33.12 80.16,35.56 U6.11 80.47,35.56 81.84,36.93 81.84,40.44 80.62,41.66 | 80.62,41.66 80.01,41.66 79.4,41.05 79.4,40.28 80.01,39.68 80.16,39.68 81.23,38.61 81.23,37.69 80.62,37.08 80.01,37.08 78.79,38.3 77.72,38.3 C56.2 | 80.62,41.66 80.62,42.11 87.63,49.12 v87.63,65.13
A
  Top 0.152: X2.3 112.01,90.73 110.64,89.36 109.88,89.36 106.83,86.31 94.18,86.31 92.51,84.63 81.38,84.63 IC2.6
B
  Top 0.152: IC2.7 93.27,85.85 94.03,86.61 106.53,86.61 110.19,90.27 X2.4
CH0  (via drill 0.35)
  Top 0.152: v54.56,34.65 56.69,34.65 U1.11 | R23.1 36.88,62.23 40.69,66.04 43.28,66.04 43.43,65.89 43.43,63.91 43.28,63.75 41.45,63.75 36.88,59.18 36.88,58.57 R13.2 36.73,58.42 36.58,58.27 v36.58,57.2
  Bottom 0.152: C28.1 51.05,35.56 51.97,34.65 v54.56,34.65 55.47,34.65 55.93,34.19 55.93,26.11 49.99,20.17 42.67,20.17 36.58,26.26 v36.58,57.2
CH1  (via drill 0.35)
  Top 0.152: R1.1 42.37,62.08 42.37,58.73 R14.2 42.22,58.57 v37.19,53.54 | v55.32,33.88 56.69,33.88 U1.12
  Bottom 0.152: v55.32,33.88 54.56,33.88 50.9,30.23 | v37.19,53.54 37.19,44.25 36.88,43.94 36.88,26.42 42.82,20.47 49.84,20.47 53.19,23.82 53.19,27.94 50.9,30.23 | 50.9,30.23 C1.1
CH2  (via drill 0.35)
  Top 0.152: R24.1 47.85,62.08 47.85,58.57 R25.2 47.85,58.42 51.21,58.42 52.73,56.9 56.08,56.9 v57.15,55.83 | v60.96,32.97 61.87,33.88 62.48,33.88 U1.17
  Bottom 0.152: C29.1 60.96,29.31 v60.96,32.97 57.15,36.78 v57.15,55.83
CH3  (via drill 0.35)
  Top 0.152: R26.1 53.34,62.08 53.34,58.57 R27.2 53.34,58.42 56.24,58.42 v58.83,55.83 | v61.11,34.04 61.57,34.49 62.48,34.49 U1.18
  Bottom 0.152: C30.1 60.96,23.98 61.87,24.89 61.87,32.97 61.11,33.73 v61.11,34.04 61.11,50.5 58.83,52.78 v58.83,55.83
CH4
  Top 0.152: R32.1 77.57,53.54 77.57,56.9 R33.2 77.42,57.05 73.3,57.05 71.93,58.42 69.8,58.42 68.12,56.74 68.12,56.13 66.9,54.92 54.71,54.92 50.9,51.11 50.9,37.39 55.63,32.66 | 55.63,32.66 55.63,26.57 56.84,25.35 C31.1 | 55.63,32.66 55.63,32.82 55.93,33.12 56.69,33.12 U1.13
CH5
  Top 0.152: R35.2 R34.1 70.87,52.78 66.75,48.67 66.75,33.88 61.57,28.7 | 61.57,28.7 62.18,28.09 C32.1 61.57,28.7 | 61.57,28.7 57.76,32.51 56.84,32.51 U1.14
CLK_SPI
  Top 0.152: AT1.13 52.73,83.57 52.73,80.82 54.71,78.84 R6.2 54.86,78.84 59.44,74.27 59.44,72.9 65.99,66.34 67.36,66.34 68.28,65.43 68.28,64.82 70.41,62.69 76.66,62.69 78.64,60.71 78.64,52.63 78.33,52.32 76.5,52.32 76.2,52.63 76.2,53.7 71.78,58.12 69.95,58.12 69.65,57.81 69.65,57.2 62.48,50.04 62.48,41.2 U1.28
DIR
  Top 0.152: 76.05,85.85 76.05,84.63 IC2.3 | 76.05,85.85 76.66,86.46 76.81,86.46 76.96,86.61 76.96,87.53 69.19,95.3 44.35,95.3 22.1,73.05 15.85,73.05 14.02,71.22 ESP32_H_2.5 | 76.05,85.85 IC2.2
EN
  Top 0.152: ESP32_H_1.4 32.31,96.52 33.98,98.2 37.64,98.2 39.32,96.52 ESP32_H_1.1
FB
  Top 0.152: U4.4 97.99,59.64 91.14,59.64 90.68,59.18 R9.2 90.68,56.29 R8.1
GND  (via drill 0.35)
  Top 0.152: X2.8 110.19,86.16 104.24,80.21 96.62,80.21 C61.2 96.47,80.21 84.43,80.21 82.3,82.35 | 93.73,99.26 94.94,99.26 C34.1 95.1,99.26 100.28,99.26 C33.1 | 93.73,99.26 91.44,101.55 L3.2 | 91.44,90.12 93.73,87.83 94.94,87.83 C20.2 95.1,87.83 100.28,87.83 C12.2 | 82.45,87.68 82.45,86.77 82.14,86.46 80.47,86.46 80.31,86.31 80.31,84.02 80.92,83.41 81.23,83.41 IC2.5 81.38,83.26 82.3,82.35 | 78.94,91.19 82.45,87.68 | 78.94,91.19 78.94,95.15 C19.1 | 78.94,91.19 C15.1 | 90.53,90.12 84.89,90.12 82.45,87.68 | 90.53,90.12 91.44,90.12 | 91.44,90.12 L2.1 | 93.73,99.26 93.73,97.59 90.53,94.39 90.53,90.12 | 55.17,93.93 55.78,93.93 C40.1 55.17,93.93 | 55.17,93.93 49.53,93.93 C6.1 | 55.17,88.75 54.41,87.99 52.27,87.99 52.12,88.14 52.12,89.81 51.82,90.12 48.46,90.12 48.31,89.97 48.31,89.81 47.7,89.2 AT1.8 47.55,89.05 v43.59,85.09 | 55.17,88.75 55.17,89.05 AT1.2 | 55.17,93.93 55.17,89.2 AT1.2 | 67.21,81.28 67.21,86.61 C13.1 67.06,86.77 57.15,86.77 55.17,88.75 | 67.21,81.28 67.21,73.66 AM1G-1205D-NZ.1 67.36,73.66 68.58,72.44 72.39,72.44 82.3,82.35 | 67.21,81.28 C37.1 | 55.17,88.75 AT1.2
  Bottom 0.152: C3.2 4.57,87.53 9.75,87.53 C18.2 9.91,87.53 15.24,87.53 C16.2 15.24,87.38 17.53,85.09 L1.2 v43.59,85.09
GND_OP  (via drill 0.35)
  Top 0.152: AT1.9 47.7,83.72 48.31,84.33 48.31,84.48 48.92,85.09 53.95,85.09 55.32,83.72 AT1.15 55.32,83.57 55.32,80.21 57.15,78.38 57.15,77.77 57.45,77.47 61.11,77.47 | 69.49,66.04 IC1.2 69.8,66.04 | 69.49,66.04 68.28,67.26 68.28,67.41 62.48,73.2 61.11,73.2 C7.2 61.11,73.35 61.11,77.47 | 61.11,77.47 61.11,78.69 C41.2 | 82.6,66.95 83.06,66.95 C14.2 | 82.6,66.95 76.5,66.95 C39.2 | 85.5,64.36 83.06,66.8 C14.2 | 85.5,64.36 87.78,62.08 90.68,62.08 R9.1 90.68,61.93 97.23,61.93 97.84,61.32 99.36,61.32 100.13,62.08 U4.1 100.13,62.23 100.89,62.23 | 82.6,66.95 82.6,73.66 AM1G-1205D-NZ.7 | 82.6,66.95 C14.2 | 100.89,62.23 105.46,66.8 C5.2 105.61,66.8 105.61,72.14 C38.2 105.46,72.29 100.43,77.32 96.62,77.32 C61.1 | 100.89,62.23 105.46,57.66 105.46,57.2 C4.2 105.46,57.05 105.46,51.11 99.36,45.01 99.36,44.4 C2.2 99.36,44.25 99.36,43.03 107.9,34.49 C22.2 108.05,34.34 108.05,33.58 109.12,32.51 109.12,12.39 | 69.49,66.04 68.89,65.43 68.89,64.67 70.56,62.99 84.12,62.99 85.5,64.36 | J7.3 73,5.69 79.4,5.69 J7.4 79.55,5.69 89.76,5.69 J3.3 | 74.98,12.39 79.4,12.39 J7.5 | 74.98,12.39 73,12.39 J7.2 73,12.24 73,5.84 J7.3 | 74.98,12.39 74.98,21.54 JP5.1 | J8.3 107.14,5.69 113.54,5.69 J8.4 | 109.12,12.39 113.54,12.39 J8.5 | 109.12,12.39 107.14,12.39 J8.2 107.14,12.24 107.14,5.84 J8.3 | J3.3 89.92,5.69 96.32,5.69 J3.4 96.47,5.69 106.98,5.69 J8.3 | 94.03,14.68 94.03,21.54 JP6.1 | 94.03,14.68 96.32,12.39 J3.5 | 94.03,14.68 91.75,12.39 89.92,12.39 J3.2 89.76,12.24 89.76,5.84 J3.3 | 57.61,35.26 56.84,35.26 U1.10 | 57.61,35.26 57.91,35.56 57.91,39.37 57.61,39.68 56.84,39.68 U1.3 56.84,39.83 56.84,40.28 U1.2 56.69,40.44 56.08,40.44 52.12,44.4 v52.12,45.01 52.12,47.75 53.34,48.97 R15.2
  Top 0.152: 57.61,35.26 60.81,32.05 64.47,32.05 66.45,34.04 66.45,43.49 63.7,46.23 63.7,46.84 C17.2 | 59.44,25.5 57,27.94 C31.2 | 59.44,25.5 59.59,25.35 62.18,25.35 C32.2 | 59.44,25.5 58.06,24.13 JP4.1 | J2.3 39.01,5.84 39.01,12.24 J2.2 | J2.4 45.57,5.84 45.57,12.24 J2.5 45.57,12.39 43.28,14.68 43.28,21.54 JP3.1 | J2.3 39.01,5.69 45.57,5.69 J2.4 | 59.13,9.2 62.33,12.39 J6.5 | 58.98,9.2 55.78,5.99 J6.3 55.63,5.84 45.72,5.84 J2.4 | 59.13,9.2 62.33,5.99 J6.4 62.48,5.84 72.85,5.84 J7.3 | 59.13,9.2 J6.1 58.98,9.2 | 58.98,9.2 55.78,12.39 J6.2 | J1.5 11.89,12.39 5.49,12.39 J1.2 5.33,12.24 5.33,5.84 J1.3 5.49,5.69 11.89,5.69 J1.4 12.04,5.69 21.95,5.69 J4.3 | J4.3 22.1,5.69 28.5,5.69 J4.4 28.65,5.69 38.86,5.69 J2.3 | 24.23,12.39 28.5,12.39 J4.5 | 24.23,12.39 22.1,12.39 J4.2 21.95,12.24 21.95,5.84 J4.3 | R33.1 77.42,59.94 70.87,59.94 R35.1 70.87,59.79 69.8,58.73 69.65,58.73 67.82,56.9 67.82,56.29 66.75,55.22 53.8,55.22 53.34,55.68 R27.1 53.19,55.83 47.85,55.83 R25.1 47.7,55.83 46.48,55.83 | 46.48,55.83 42.37,55.83 R14.1 | v24.69,62.54 30.63,62.54 C24.2 30.79,62.54 31.39,63.14 37.19,63.14 40.39,66.34 43.43,66.34 43.74,66.04 | 43.74,66.04 43.74,63.75 43.43,63.45 41.6,63.45 41.15,62.99 41.15,60.86 36.88,56.59 36.88,55.83 R13.1 | 14.02,25.5 15.24,24.28 JP1.1 | 14.02,25.5 11.58,27.94 11.58,30.38 C68.2 11.43,30.53 10.52,31.45 10.52,39.07 12.04,40.59 12.04,43.03 C66.2 | 14.02,25.5 12.65,24.13 10.67,24.13 9.91,24.89 9.91,31.45 4.88,36.47 4.88,37.85 C26.2 | 46.48,55.83 46.48,62.84 47.4,63.75 48.62,63.75 48.92,64.06 48.92,65.89 48.77,66.04 43.74,66.04 | 24.23,12.39 24.23,21.54 JP2.1
  Bottom 0.152: C43.1 68.73,43.94 68.73,38.61 C11.1 68.73,38.46 74.68,38.46 C56.1 74.83,38.3 74.83,33.12 C55.1 74.68,32.97 70.1,32.97 | 63.7,26.57 63.7,29.16 C29.2 | 63.7,26.57 63.7,23.98 C30.2 | 70.1,32.97 70.1,27.94 C9.2 | 70.1,32.97 C44.2 | JP5.1 74.83,21.69 74.83,23.22 70.26,27.79 C9.2 | 63.7,26.57 68.89,26.57 70.1,27.79 C9.2 | C51.1 94.18,38 94.18,32.82 C52.1 94.03,32.66 94.03,21.69 JP6.1 | 51.97,24.13 49.53,21.69 43.28,21.69 JP3.1 | C10.1 55.78,50.8 55.78,45.77 C42.1 55.63,45.62 52.73,45.62 v52.12,45.01 48.16,41.05 C8.1 48.16,40.89 48.16,35.56 C28.2 48.01,35.56 48.01,33.58 | 48.01,33.58 C1.2 | 48.01,33.58 43.43,33.58 | 43.43,33.58 43.43,38.91 C62.1 | 43.43,33.58 C63.1 | 51.97,24.13 51.97,26.26 C1.2 | 51.97,24.13 JP4.1 | C1.2 | 18.75,63.6 21.34,63.6 22.4,64.67 C45.1 22.55,64.67 v24.69,62.54 | 18.75,63.6 14.94,63.6 13.87,64.67 13.11,64.67 C46.1 | 18.75,50.8 21.64,50.8 22.86,49.58 C53.1 23.01,49.43 23.01,38.61 23.77,37.85 C65.1 23.93,37.85 23.93,32.82 C64.1 23.93,32.66 23.93,21.69 | 18.75,50.8 14.48,50.8 13.26,49.58 12.65,49.58 C54.1 | 23.93,21.69 17.68,21.69 JP1.1 | 23.93,21.69 24.08,21.69 JP2.1 23.93,21.69 | 18.75,50.8 18.75,63.6
MC_MISO/!DRDY
  Top 0.152: AT1.6 50.14,89.05 33.83,72.75 28.19,72.75 26.67,71.22 ESP32_H_2.10
MC_MOSI
  Top 0.152: AT1.5 51.36,89.05 51.36,88.75 47.4,84.78 47.24,84.78 39.47,77.01 39.47,71.22 ESP32_H_2.15
MC_RESET
  Top 0.152: AT1.3 53.95,89.2 53.34,89.81 53.34,89.97 52.58,90.73 41.15,90.73 21.64,71.22 ESP32_H_2.8
MC_SCLK
  Top 0.152: ESP32_H_2.9 43.43,90.42 51.97,90.42 52.58,89.81 52.58,89.2 AT1.4
MISO/!DRDY  (via drill 0.35)
  Top 0.152: AT1.11 50.14,83.57 50.14,80.52 48.46,78.84 R11.2 48.31,78.69 47.24,77.62 47.24,72.29 47.4,72.14 48.16,72.14 v61.72,58.57 | v61.72,44.7 61.42,44.4 61.42,40.13 61.72,39.83 62.48,39.83 U1.26
  Bottom 0.152: v61.72,58.57 v61.72,44.7
MOSI  (via drill 0.35)
  Top 0.152: AT1.12 51.36,83.57 51.36,80.21 49.53,78.38 49.53,74.57 48.31,73.35 R10.2 48.31,73.2 v63.7,57.81 | v63.7,45.31 63.7,40.89 63.25,40.44 62.64,40.44 U1.27
  Bottom 0.152: v63.7,57.81 v63.7,45.31
N$1
  Bottom 0.152: R41.1 79.86,22.76 79.86,27.18 79.4,27.63 79.4,29.46 80.31,30.38 U6.13
N$2
  Bottom 0.152: R42.1 92.66,29.01 89.76,29.01 88.39,30.38 U6.2
N$3
  Top 0.152: R18.1 101.5,34.49 91.9,34.49 88.39,38 U6.5
N$6
  Top 0.152: U4.3 97.99,62.23 97.99,65.73 95.25,68.48 R7.2
N$8  (via drill 0.35)
  Top 0.152: v52.27,39.68 56.08,35.87 56.69,35.87 U1.9
  Bottom 0.152: v52.27,39.68 51.05,40.89 C8.2
N$11
  Top 0.152: U1.24 62.48,38.46 61.87,38.46 61.11,39.22 61.11,45.01 61.87,45.77 61.87,54.46 61.72,54.61 59.74,54.61 54.56,49.43 54.56,48.21 53.34,46.99 R15.1
N$12  (via drill 0.35)
  Top 0.152: v30.79,58.27 30.79,59.64 C24.1 | C25.1 31.85,50.8 30.48,52.17 R4.1 30.48,52.32 30.94,52.78 v30.94,53.7
  Bottom 0.152: v30.79,58.27 33.07,55.98 R12.2 33.07,55.83 v30.94,53.7
N$15
  Bottom 0.152: R12.1 30.33,55.98 25.45,55.98 20.42,61.01 U3.3
N$16  (via drill 0.35)
  Top 0.152: 4.88,44.4 4.88,44.7 R20.2 4.88,44.4 | 4.88,44.4 4.88,40.89 C26.1 4.88,40.74 7.47,38.15 8.69,38.15 R19.1 | 4.88,44.4 v6.4,44.4
  Bottom 0.152: v6.4,44.4 8.84,44.4 C27.1
N$18
  Top 0.152: U3.5 15.24,54.46 8.53,47.75 4.88,47.75 R20.1
N$19  (via drill 0.35)
  Top 0.152: C2.1 99.21,47.14 90.68,47.14 88.39,49.43 R3.1 88.39,49.58 v87.02,50.95
  Bottom 0.152: C21.1 76.2,47.9 79.1,50.8 81.38,50.8 82.6,49.58 R16.2 82.75,49.58 85.65,49.58 v87.02,50.95
N$20
  Top 0.152: 14.17,47.3 15.09,48.21 R43.2 | 14.17,47.3 12.8,45.92 12.19,45.92 C66.1 | C67.1 22.1,45.47 20.57,45.47 18.44,43.33 R40.1 18.29,43.18 14.17,47.3
N$21
  Top 0.152: 101.65,28.09 101.65,31.6 R18.2 | C22.1 108.05,31.6 108.05,28.09 R17.1 107.9,28.09 101.65,28.09 | 101.65,28.09 C23.1
N$30
  Top 0.152: 5.18,25.2 8.69,25.2 R45.2 | C68.1 8.69,30.38 5.18,30.38 C69.1 5.18,30.23 5.18,25.2 | 5.18,25.2 R44.1
N$37
  Top 0.152: R43.1 17.98,48.36 17.98,50.8 20.27,53.09 U3.12
N$38
  Top 0.152: R45.1 11.43,25.35 11.43,27.63 10.21,28.85 10.21,48.06 15.24,53.09 U3.10
N$44
  Bottom 0.152: R36.1 26.06,29.01 28.04,29.01 29.72,30.68 U7.13
N$45
  Bottom 0.152: R37.1 26.06,42.11 28.5,42.11 29.72,40.89 U7.9
N$46
  Bottom 0.152: R38.1 39.93,43.03 37.8,40.89 U7.6 | R38.1
N$47
  Bottom 0.152: R39.1 41.76,29.46 39.01,29.46 37.8,30.68 U7.2
OUT1
  Top 0.152: C69.2 5.03,33.27 5.03,35.71 3.66,37.08 3.66,48.51 8.23,53.09 10.06,53.09 U3.8 10.21,53.24 12.65,53.24 U3.9 12.8,53.24 12.8,59.94 17.68,64.82 36.73,64.82 R23.2
OUT1_WT
  Top 0.152: R44.2 5.18,22.45 23.47,22.45 28.19,27.18 36.73,27.18 37.64,28.09 U7.1
  Bottom 0.152: R39.2 41.76,26.57 39.32,26.57 37.8,28.09 U7.1
OUT2
  Top 0.152: C67.2 22.25,48.51 22.25,52.48 22.86,53.09 U3.13 22.86,53.24 25.3,53.24 U3.14 25.45,53.24 26.67,53.24 33.07,59.64 36.42,59.64 41.6,64.82 42.22,64.82 R1.2
OUT2_WT
  Top 0.152: R40.2 18.44,40.59 28.19,40.59 30.02,42.42 36.73,42.42 37.64,43.33 U7.7
  Bottom 0.152: R38.2 41.91,45.77 40.08,45.77 37.8,43.49 U7.7
OUT3
  Top 0.152: U3.1 25.3,61.16 22.86,61.16 U3.2 22.86,54.46 21.03,52.63 21.03,47.45 21.18,47.3 26.36,47.3 29.57,50.5 33.68,50.5 34.59,49.58 36.88,49.58 38.1,50.8 C25.2 38.25,50.8 38.25,53.85 42.06,57.66 43.28,57.66 46.18,60.55 46.18,63.3 47.7,64.82 R24.2
OUT3_WT
  Top 0.152: R4.2 30.48,44.09 29.87,43.49 U7.8
  Bottom 0.152: R37.2 26.06,44.86 28.35,44.86 29.72,43.49 U7.8
OUT4
  Top 0.152: R26.2 53.19,64.97 50.29,64.97 48.62,66.65 18.29,66.65 12.8,61.16 U3.6 12.65,61.16 10.21,61.16 U3.7
  Bottom 0.152: C27.2 8.99,47.14 8.99,59.94 10.06,61.01 U3.7
OUT4_WT
  Top 0.152: R19.2 11.58,38 19.96,38 29.72,28.25 U7.14
  Bottom 0.152: R36.2 26.06,26.26 27.89,26.26 29.72,28.09 U7.14
OUT5
  Top 0.152: R32.2 77.57,50.8 86.26,50.8 87.17,49.89 87.17,44.25 88.24,43.18 U6.7 88.39,43.18 88.39,40.74 U6.6 88.24,40.59 87.33,39.68 87.33,27.18 89.15,25.35 101.5,25.35 C23.2
OUT5_WT
  Top 0.152: R17.2 107.9,25.35 103.63,25.35 101.96,27.03 89.31,27.03 88.39,27.94 U6.1
  Bottom 0.152: R42.2 92.66,26.26 90.07,26.26 88.39,27.94 U6.1
OUT6
  Top 0.152: R34.2 72.85,50.65 80.31,43.18 U6.8 80.47,43.18 80.47,40.74 U6.9 | R34.2
  Bottom 0.152: C21.2 76.2,37.69 77.11,36.78 80.77,36.78 81.53,37.54 81.53,39.52 80.47,40.59 U6.9
OUT6_WT
  Top 0.152: R3.2 85.34,49.43 85.34,32.82 80.47,27.94 U6.14
  Bottom 0.152: R41.2 82.75,22.76 82.75,25.65 80.47,27.94 U6.14
RESET_ADC  (via drill 0.35)
  Top 0.152: AT1.14 53.95,83.72 53.34,84.33 53.34,84.48 53.03,84.78 52.43,84.78 52.12,84.48 52.12,80.67 53.65,79.15 53.65,74.42 54.71,73.35 R5.2 54.71,73.2 v53.49,71.98 | v51.51,50.8 51.51,43.64 55.93,39.22 56.69,39.22 U1.4
  Bottom 0.152: v51.51,50.8 51.51,70 v53.49,71.98
RX2
  Top 0.152: ESP32_H_2.6 18.14,72.75 22.25,72.75 44.5,95 63.86,95 71.63,87.22 75.89,87.22 IC2.1
START
  Top 0.152: U1.23 62.48,37.85 61.87,37.85 60.81,38.91 60.81,46.84 C17.1 60.81,46.99 60.81,50.65 R2.1
TX2  (via drill 0.35)
  Top 0.152: v70.56,83.26 75.89,83.26 IC2.4
  Bottom 0.152: v70.56,83.26 31.09,83.26 19.05,71.22 ESP32_H_2.7
(copper drawn outside any net)
  shapes: Top area x4